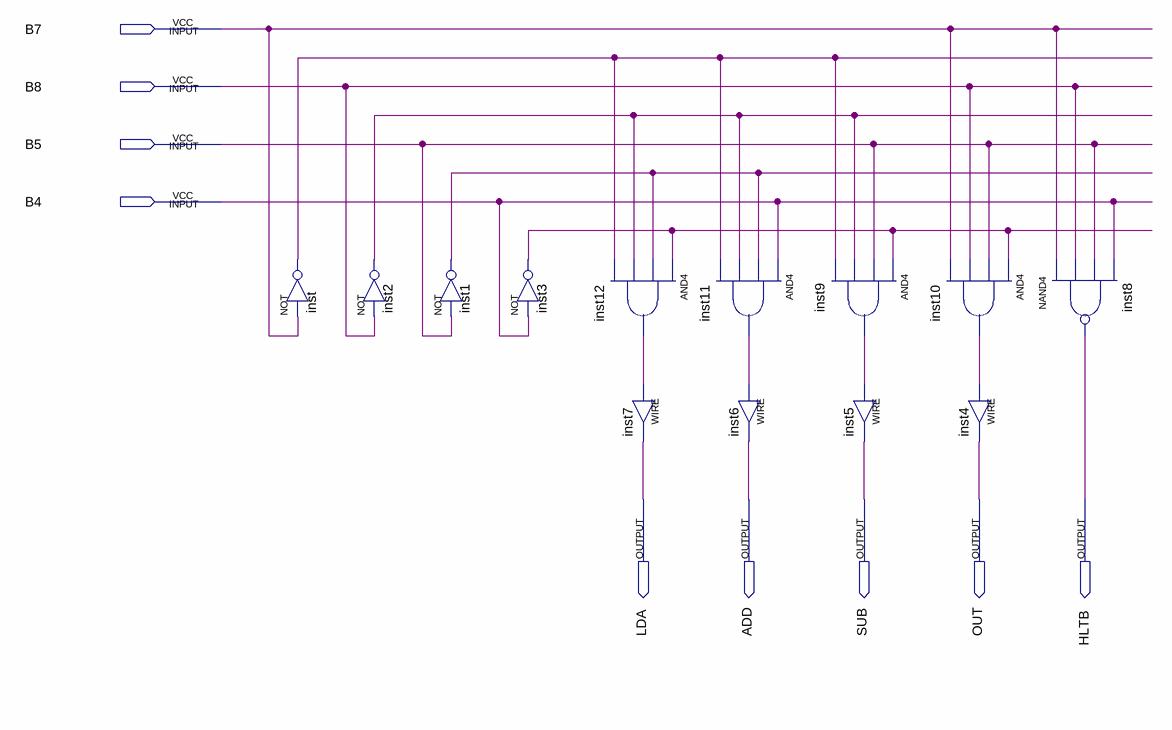
[diagram p0: schematic sheet]
// Quartus schematic Decodificador.bdf as structural Verilog: 13 symbols, 9 pins
module Decodificador (
  input  B7,
  input  B8,
  input  B5,
  input  B4,
  output LDA,
  output ADD,
  output SUB,
  output OUT,
  output HLTB
);

  wire inst1_out, inst2_out, inst3_out, inst9_out, inst10_out, inst11_out, inst12_out, inst_out;

  not inst (inst_out, B7);
  not inst2 (inst2_out, B8);
  not inst1 (inst1_out, B5);
  not inst3 (inst3_out, B4);
  and inst12 (inst12_out, inst3_out, inst1_out, inst2_out, inst_out);
  assign LDA = inst12_out;  // WIRE inst7
  and inst11 (inst11_out, B4, inst1_out, inst2_out, inst_out);
  assign ADD = inst11_out;  // WIRE inst6
  and inst9 (inst9_out, inst3_out, B5, inst2_out, inst_out);
  assign SUB = inst9_out;  // WIRE inst5
  and inst10 (inst10_out, inst3_out, B5, B8, B7);
  assign OUT = inst10_out;  // WIRE inst4
  nand inst8 (HLTB, B7, B8, B5, B4);
endmodule
